# Altium schematic sheet connectorA.SchDoc
size A4
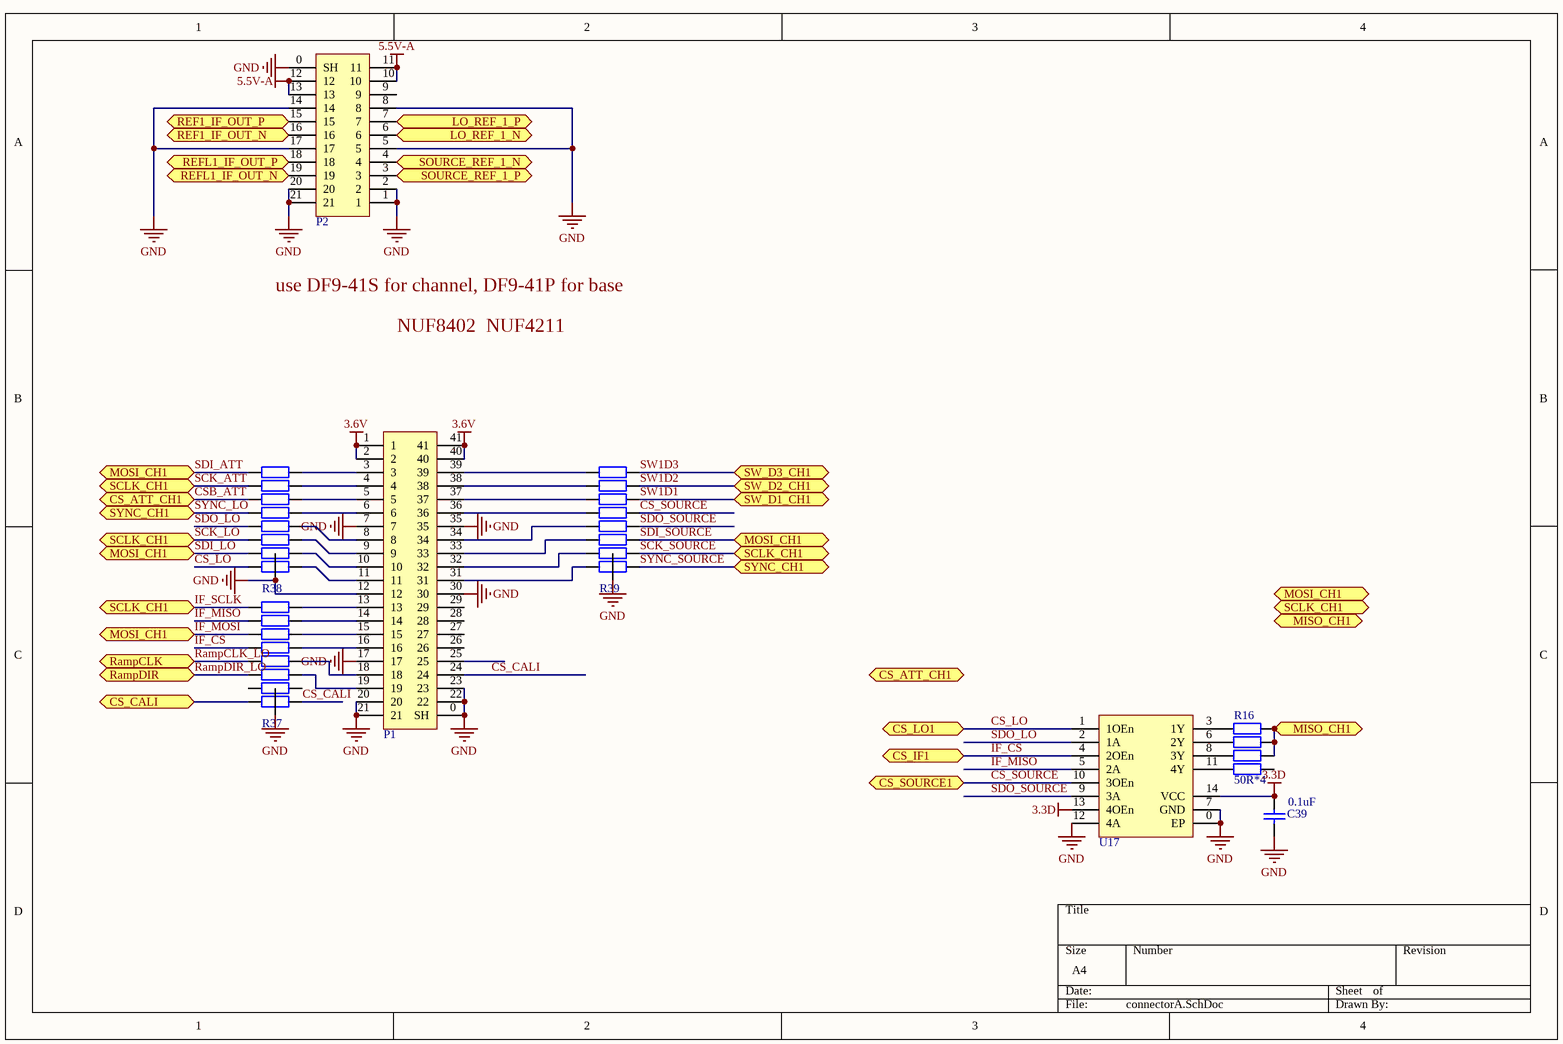
[diagram p0: connectorA.SchDoc]

## Parts
C39  0.1uF  [0402]
P1  DF9-41S  [VNA_CHANNEL]  (value not drawn)
P2  DF9-21  [DF9-21P]  (value not drawn)
R16  50R*4  [0402X4]
R37  NUF8xxx  [NUF8xxx]  (value not drawn)
R38  NUF8xxx  [NUF8xxx]  (value not drawn)
R39  NUF8xxx  [NUF8xxx]  (value not drawn)
U17  74-125-FUNC  [74LVC125ABQ]  (value not drawn)

## Ports
CS_ATT_CH1, CS_CALI, CS_IF1, CS_LO1, CS_SOURCE1, LO_REF_1_N, LO_REF_1_P, MISO_CH1, MOSI_CH1, RampCLK, RampDIR, REF1_IF_OUT_N, REF1_IF_OUT_P, REFL1_IF_OUT_N, REFL1_IF_OUT_P, SCLK_CH1, SOURCE_REF_1_N, SOURCE_REF_1_P, SW_D1_CH1, SW_D2_CH1, SW_D3_CH1, SYNC_CH1

## Nets
3.3D: C39.2 U17.13(4OEn) U17.14(VCC)
3.6V: P1.1 P1.2 P1.40 P1.41
5.5V-A: P2.10 P2.11 P2.12 P2.13
GND: C39.1 P1.0(SH) P1.7 P1.12 P1.17 P1.20 P1.21 P1.22 P1.23 P1.30 P1.35 P2.0(SH) P2.1 P2.2 P2.5 P2.8 P2.14 P2.17 P2.20 P2.21 R37.0 R38.0 R39.0 U17.0(EP) U17.7(GND) U17.12(4A)
CS_CALI: P1.24 R37.8
CS_CALI: R37.9 ; port CS_CALI  [a separate net that carries the same name]
CS_LO: R38.9 U17.1(1OEn) ; port CS_LO1
CS_SOURCE: R39.4 U17.10(3OEn) ; port CS_SOURCE1
CSB_ATT: R38.14 ; port CS_ATT_CH1
IF_CS: R37.13 U17.4(2OEn) ; port CS_IF1
IF_MISO: R37.15 U17.5(2A)
IF_MOSI: R37.14 R38.10 R38.16 R39.6 ; port MOSI_CH1  [also labelled SDI_ATT, SDI_LO, SDI_SOURCE]
IF_SCLK: R37.16 R38.11 R38.15 R39.7 ; port SCLK_CH1  [also labelled SCK_ATT, SCK_LO, SCK_SOURCE]
LO_REF_1_N: P2.6 ; port LO_REF_1_N
LO_REF_1_P: P2.7 ; port LO_REF_1_P
MISO_CH1: R16.6 R16.7 R16.8 ; port MISO_CH1
RampCLK_LO: R37.12 ; port RampCLK
RampDIR_LO: R37.11 ; port RampDIR
REF1_IF_OUT_N: P2.16 ; port REF1_IF_OUT_N
REF1_IF_OUT_P: P2.15 ; port REF1_IF_OUT_P
REFL1_IF_OUT_N: P2.19 ; port REFL1_IF_OUT_N
REFL1_IF_OUT_P: P2.18 ; port REFL1_IF_OUT_P
SDO_LO: R38.12 U17.2(1A)
SDO_SOURCE: R39.5 U17.9(3A)
SOURCE_REF_1_N: P2.4 ; port SOURCE_REF_1_N
SOURCE_REF_1_P: P2.3 ; port SOURCE_REF_1_P
SW1D1: R39.3 ; port SW_D1_CH1
SW1D2: R39.2 ; port SW_D2_CH1
SW1D3: R39.1 ; port SW_D3_CH1
SYNC_LO: R38.13 R39.8 ; port SYNC_CH1  [also labelled SYNC_SOURCE]
NetP1_3: P1.3 R38.1
NetP1_4: P1.4 R38.2
NetP1_5: P1.5 R38.3
NetP1_6: P1.6 R38.4
NetP1_8: P1.8 R38.5
NetP1_9: P1.9 R38.6
NetP1_10: P1.10 R38.7
NetP1_11: P1.11 R38.8
NetP1_13: P1.13 R37.1
NetP1_14: P1.14 R37.2
NetP1_15: P1.15 R37.3
NetP1_16: P1.16 R37.4
NetP1_18: P1.18 R37.5
NetP1_19: P1.19 R37.6
NetP1_31: P1.31 R39.9
NetP1_32: P1.32 R39.10
NetP1_33: P1.33 R39.11
NetP1_34: P1.34 R39.12
NetP1_36: P1.36 R39.13
NetP1_37: P1.37 R39.14
NetP1_38: P1.38 R39.15
NetP1_39: P1.39 R39.16
NetR16_1: R16.1 U17.3(1Y)
NetR16_2: R16.2 U17.6(2Y)
NetR16_3: R16.3 U17.8(3Y)
NetR16_4: R16.4 U17.11(4Y)

Not connected (* = marked no-connect by the designer): P1 25 26 27 28 29; P2 9; R16 5; R37 7 10

## Notes on the sheet
- use DF9-41S for channel, DF9-41P for base
- NUF8402  NUF4211

## Library data of the parts
C39 = Cap: Capacitor
R16 = Res*4: Resistor; Published: 8-Jun-2000; LatestRevisionDate: 17-Jul-2002; LatestRevisionNote: Re-released for DXP Platform.; PackageReference: AXIAL-0.4; Publisher: Altium Limited; PackageDescription: Axial Device, Thru-Hole; 2 Leads; 0.4 in Pin Spacing